# EAGLE design SprinklerController (EAGLE 7.6.0)
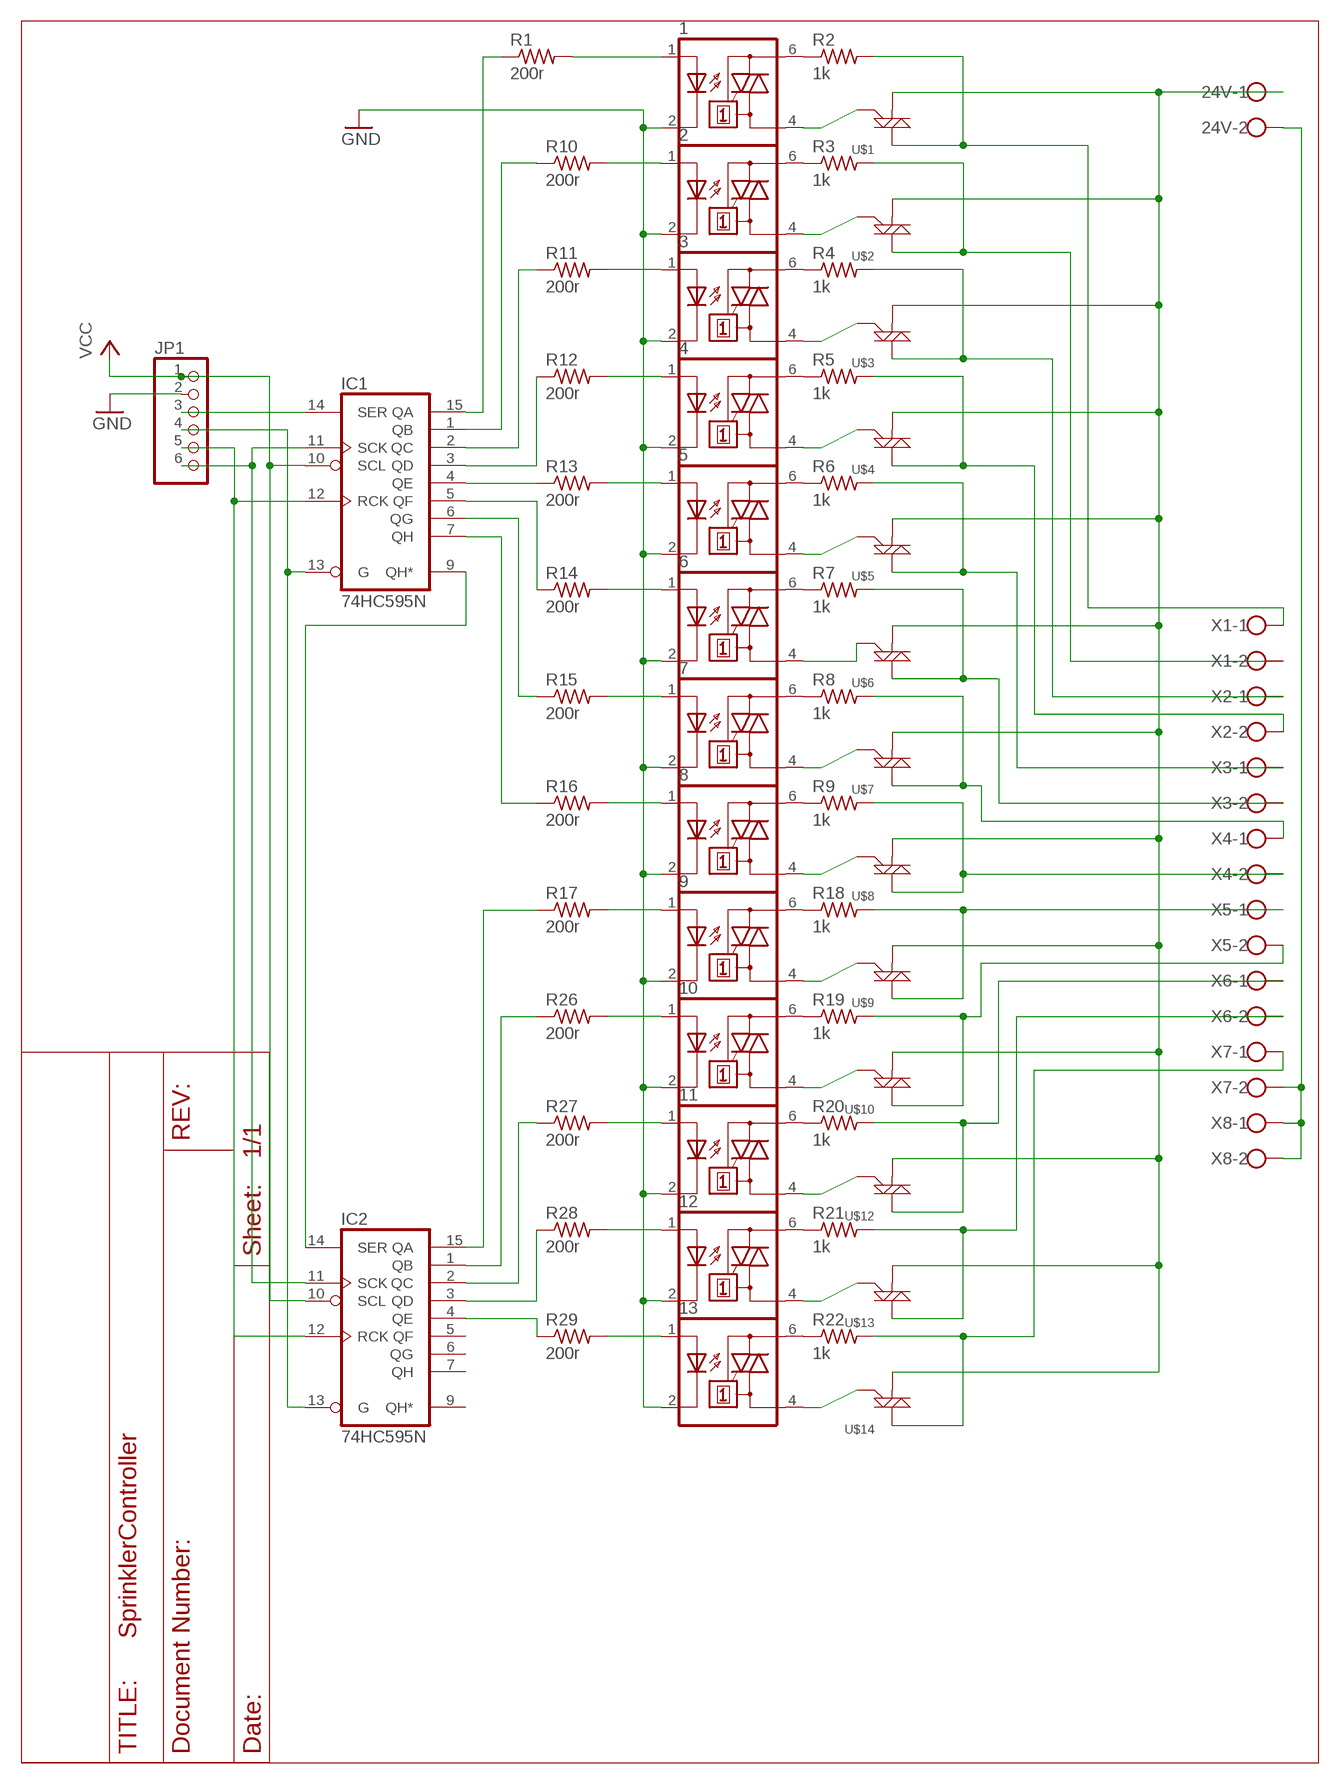
[diagram p0: schematic, sheet 1]

## Parts
1  MOC3021M  [DIL06]
2  MOC3021M  [DIL06]
3  MOC3021M  [DIL06]
4  MOC3021M  [DIL06]
5  MOC3021M  [DIL06]
6  MOC3021M  [DIL06]
7  MOC3021M  [DIL06]
8  MOC3021M  [DIL06]
9  MOC3021M  [DIL06]
10  MOC3021M  [DIL06]
11  MOC3021M  [DIL06]
12  MOC3021M  [DIL06]
13  MOC3021M  [DIL06]
24V  W237-102  [W237-102]
IC1  74HC595N  74LS595N  [DIL16]
IC2  74HC595N  74LS595N  [DIL16]
JP1  PINHD-1X6  [1X06]
R1  200r  R-US_0204/7  [0204/7]
R2  1k  R-US_0204/7  [0204/7]
R3  1k  R-US_0204/7  [0204/7]
R4  1k  R-US_0204/7  [0204/7]
R5  1k  R-US_0204/7  [0204/7]
R6  1k  R-US_0204/7  [0204/7]
R7  1k  R-US_0204/7  [0204/7]
R8  1k  R-US_0204/7  [0204/7]
R9  1k  R-US_0204/7  [0204/7]
R10  200r  R-US_0204/7  [0204/7]
R11  200r  R-US_0204/7  [0204/7]
R12  200r  R-US_0204/7  [0204/7]
R13  200r  R-US_0204/7  [0204/7]
R14  200r  R-US_0204/7  [0204/7]
R15  200r  R-US_0204/7  [0204/7]
R16  200r  R-US_0204/7  [0204/7]
R17  200r  R-US_0204/7  [0204/7]
R18  1k  R-US_0204/7  [0204/7]
R19  1k  R-US_0204/7  [0204/7]
R20  1k  R-US_0204/7  [0204/7]
R21  1k  R-US_0204/7  [0204/7]
R22  1k  R-US_0204/7  [0204/7]
R26  200r  R-US_0204/7  [0204/7]
R27  200r  R-US_0204/7  [0204/7]
R28  200r  R-US_0204/7  [0204/7]
R29  200r  R-US_0204/7  [0204/7]
U$1  TRIACPTH  [TO-92]
U$2  TRIACPTH  [TO-92]
U$3  TRIACPTH  [TO-92]
U$4  TRIACPTH  [TO-92]
U$5  TRIACPTH  [TO-92]
U$6  TRIACPTH  [TO-92]
U$7  TRIACPTH  [TO-92]
U$8  TRIACPTH  [TO-92]
U$9  TRIACPTH  [TO-92]
U$10  TRIACPTH  [TO-92]
U$12  TRIACPTH  [TO-92]
U$13  TRIACPTH  [TO-92]
U$14  TRIACPTH  [TO-92]
X1  W237-102  [W237-102]
X2  W237-102  [W237-102]
X3  W237-102  [W237-102]
X4  W237-102  [W237-102]
X5  W237-102  [W237-102]
X6  W237-102  [W237-102]
X7  W237-102  [W237-102]
X8  W237-102  [W237-102]

## Nets
GND: 1.2(C) 2.2(C) 3.2(C) 4.2(C) 5.2(C) 6.2(C) 7.2(C) 8.2(C) 9.2(C) 10.2(C) 11.2(C) 12.2(C) 13.2(C) JP1.2
N$1: IC1.12(RCK) IC2.12(RCK) JP1.5
N$2: IC1.14(SER) JP1.3
N$3: IC1.13(G) IC2.13(G) JP1.4
N$4: 1.4(A1) U$1.2(G)
N$5: IC1.11(SCK) IC2.11(SCK) JP1.6
N$6: R19.2 U$10.3(M2) X5.2
N$7: R2.2 U$1.3(M2) X1.1
N$8: 24V.1 U$1.1(M1) U$2.1(M1) U$3.1(M1) U$4.1(M1) U$5.1(M1) U$6.1(M1) U$7.1(M1) U$8.1(M1) U$9.1(M1) U$10.1(M1) U$12.1(M1) U$13.1(M1) U$14.1(M1)
N$9: 1.1(A) R1.2
N$10: IC1.9(QH*) IC2.14(SER)
N$11: IC1.7(QH) R16.1
N$12: 1.6(A2) R2.1
N$13: 2.6(A2) R3.1
N$14: 3.6(A2) R4.1
N$15: 4.6(A2) R5.1
N$16: 5.6(A2) R6.1
N$17: 6.6(A2) R7.1
N$18: 7.6(A2) R8.1
N$19: 8.6(A2) R9.1
N$20: 10.4(A1) U$10.2(G)
N$21: 24V.2 X7.2 X8.1 X8.2
N$24: 13.4(A1) U$14.2(G)
N$25: 12.4(A1) U$13.2(G)
N$26: 11.4(A1) U$12.2(G)
N$27: R4.2 U$3.3(M2) X2.1
N$28: R5.2 U$4.3(M2) X2.2
N$29: R6.2 U$5.3(M2) X3.1
N$30: R7.2 U$6.3(M2) X3.2
N$31: R8.2 U$7.3(M2) X4.1
N$32: 2.1(A) R10.2
N$33: 9.4(A1) U$9.2(G)
N$34: 3.1(A) R11.2
N$35: 4.1(A) R12.2
N$36: R9.2 U$8.3(M2) X4.2
N$37: 5.1(A) R13.2
N$38: 6.1(A) R14.2
N$39: 7.1(A) R15.2
N$40: 8.1(A) R16.2
N$41: IC1.6(QG) R15.1
N$42: IC1.5(QF) R14.1
N$43: IC1.4(QE) R13.1
N$44: IC1.3(QD) R12.1
N$45: IC1.2(QC) R11.1
N$46: IC1.1(QB) R10.1
N$47: 8.4(A1) U$8.2(G)
N$48: IC1.15(QA) R1.1
N$49: IC2.4(QE) R29.1
N$50: 9.6(A2) R18.1
N$51: 10.6(A2) R19.1
N$52: 11.6(A2) R20.1
N$53: 12.6(A2) R21.1
N$54: 13.6(A2) R22.1
N$58: 7.4(A1) U$7.2(G)
N$59: 6.4(A1) U$6.2(G)
N$60: 5.4(A1) U$5.2(G)
N$61: 4.4(A1) U$4.2(G)
N$62: 3.4(A1) U$3.2(G)
N$63: 2.4(A1) U$2.2(G)
N$65: R20.2 U$12.3(M2) X6.1
N$66: R21.2 U$13.3(M2) X6.2
N$67: R22.2 U$14.3(M2) X7.1
N$70: R3.2 U$2.3(M2) X1.2
N$71: R18.2 U$9.3(M2) X5.1
N$73: 9.1(A) R17.2
N$74: 10.1(A) R26.2
N$75: 11.1(A) R27.2
N$76: 12.1(A) R28.2
N$77: 13.1(A) R29.2
N$81: IC2.15(QA) R17.1
N$84: IC2.1(QB) R26.1
N$85: IC2.2(QC) R27.1
N$86: IC2.3(QD) R28.1
VCC: IC1.10(SCL) IC2.10(SCL) JP1.1
Unconnected: IC2.5(QF) IC2.6(QG) IC2.7(QH) IC2.9(QH*)

## Power pins joined to a net without a drawn wire
GND: IC1.8(GND) IC2.8(GND)
VCC: IC1.16(VCC) IC2.16(VCC)

## Library data of the parts
1-13 = optocoupler:MOC30*M: RANDOM-PHASE OPTOISOLATORS TRIAC DRIVER OUTPUT Source: http://www.fairchildsemi.com MOC3020-M.pdf; MF: FAIRCHILD SEMICONDUCTOR; MPN: MOC3021-M; OC_FARNELL: 1021365; OC_NEWARK: 95B7895
24V X1-X8 = con-wago-500:W237-102: WAGO SCREW CLAMP; MPN: 237-102; OC_FARNELL: unknown; OC_NEWARK: 70K9898
IC1 IC2 = 74xx-us:74*595: 8-bit SHIFT REGISTER, output latch
JP1 = pinhead:PINHD-1X6: PIN HEADER
R1-R22 R26-R29 = rcl:R-US_: RESISTOR, American symbol
U$1-U$10 U$12-U$14 = SparkFun-DiscreteSemi:TRIAC: Low-power generic TRIAC packages

## Board
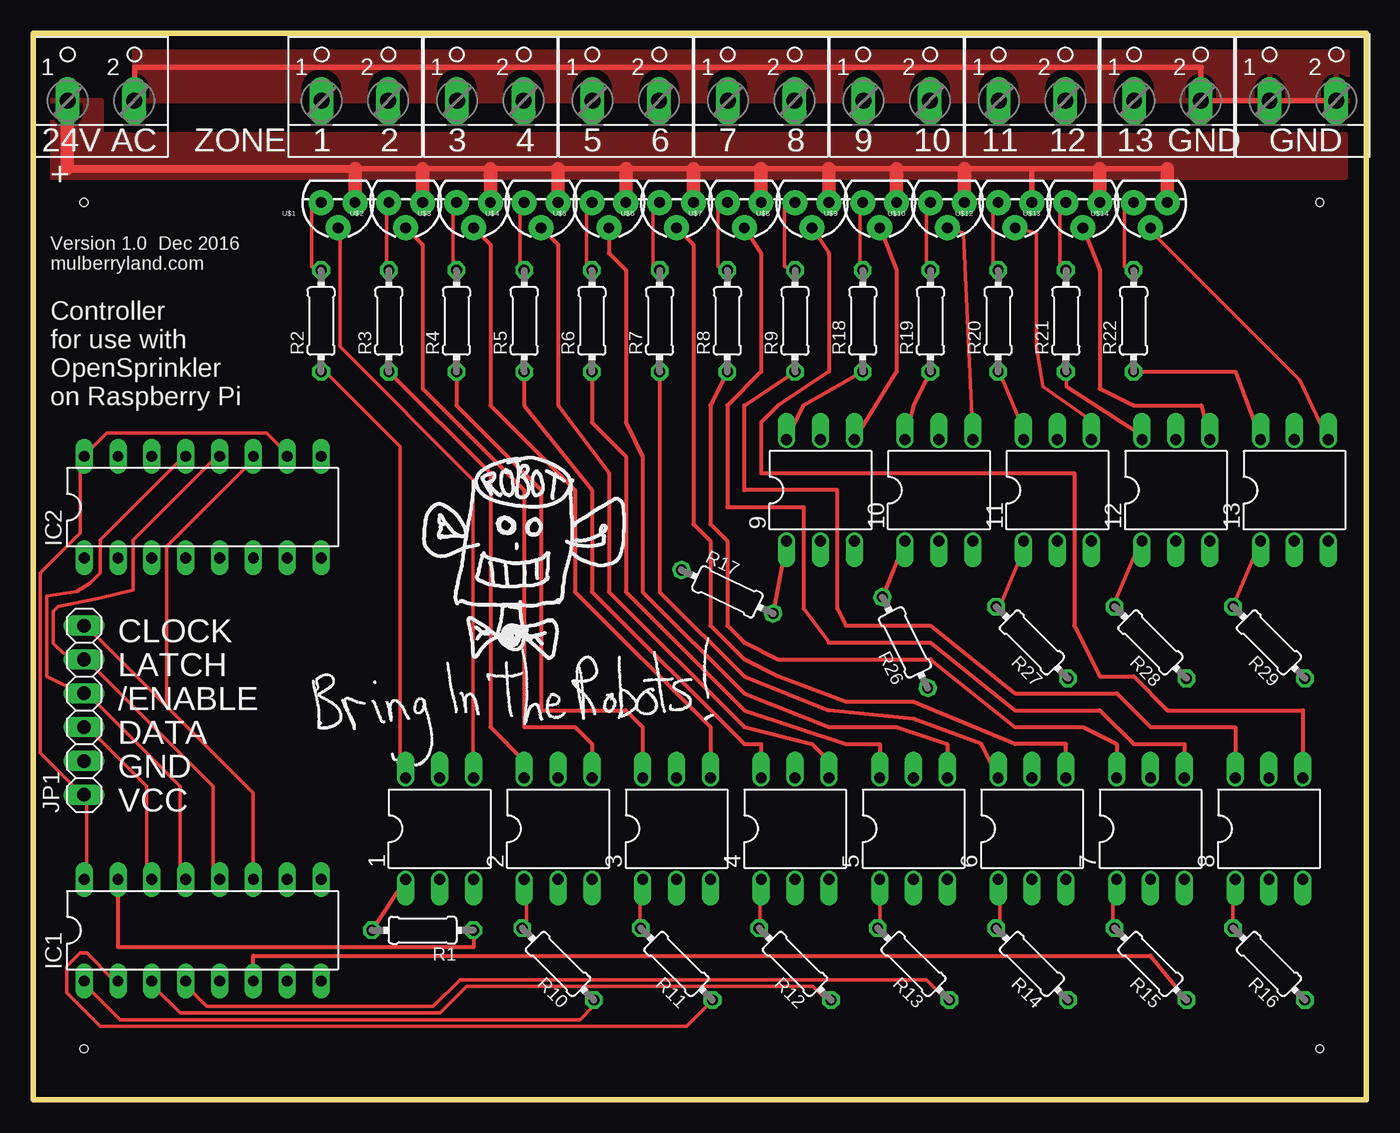
[diagram p1: board, top side]
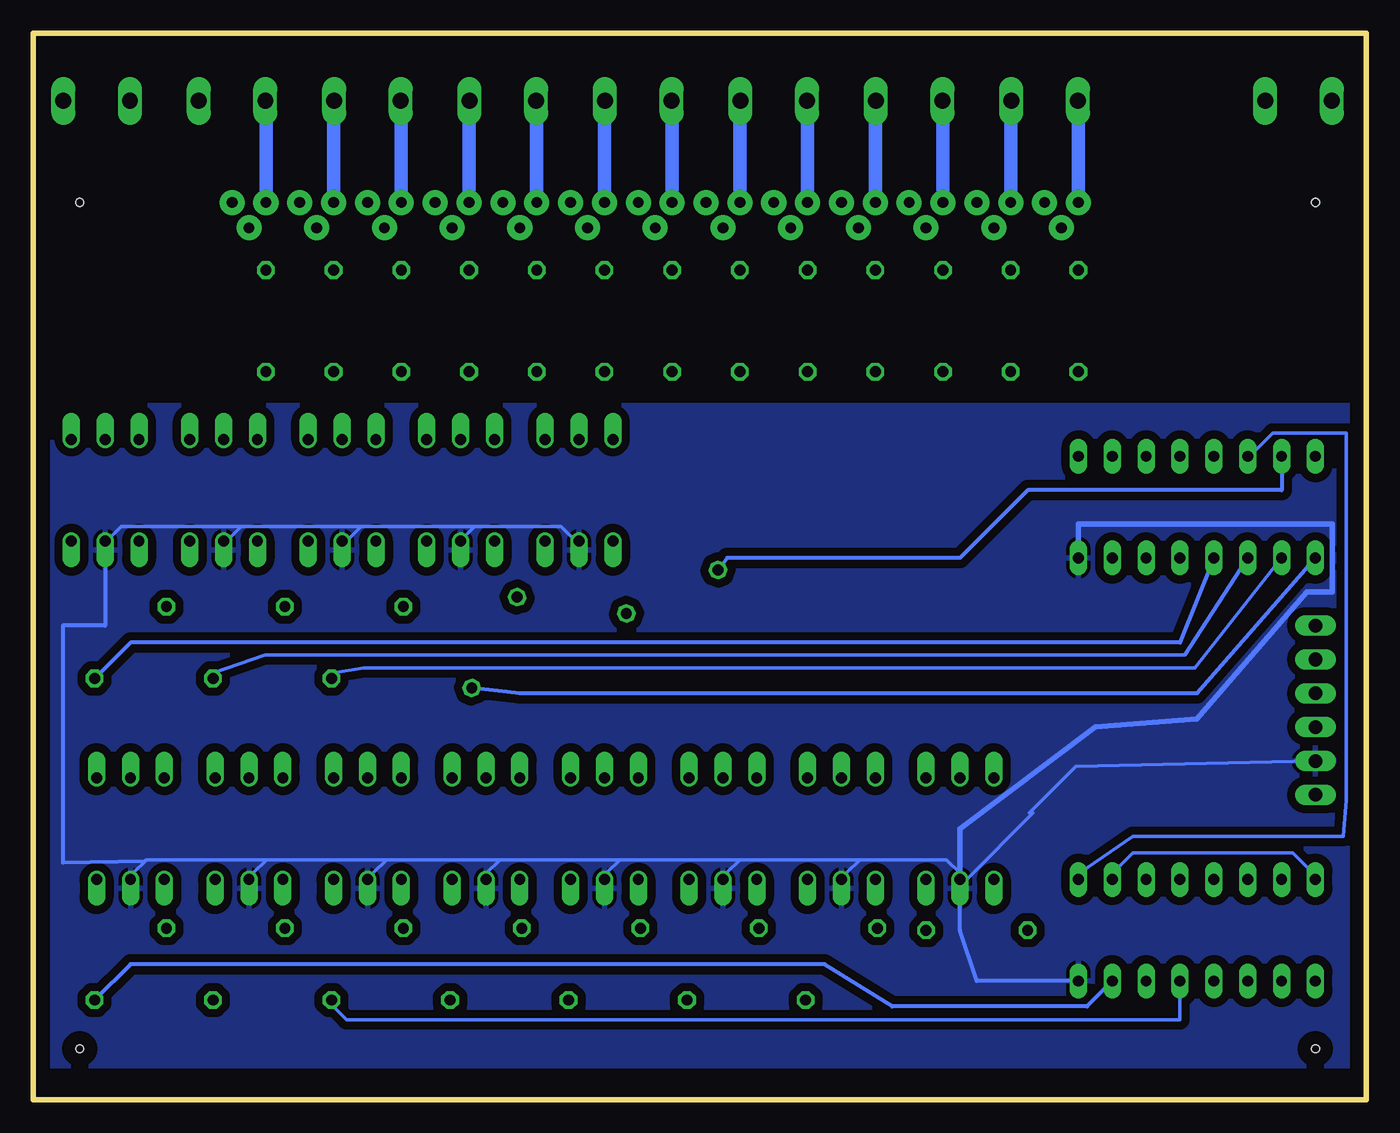
[diagram p2: board, bottom side, seen from below]

Size 100 x 80 mm. Coordinates in mm from the lower left corner, seen from the top.
Outline: 0,0 100,0 100,80 0,80 0,0
Copper layers (1*16): Top 0.035mm / dielectric 1.5mm / Bottom 0.035mm
Design rules "default": minimum track width 10mil, minimum drill 24mil, track to track 8mil, track to pad 8mil, pad to pad 8mil, via to via 8mil, smd to smd 8mil, copper to edge 40mil, drill to drill 8mil, minimum pad ring 10mil, minimum via ring 8mil, stop-mask expansion 4mil, vias tented up to drill 0mil, thermal gap 10mil
Holes 0.6 mm at 96.52,67.31 96.52,3.81 3.81,3.81 3.81,67.31

### Footprints (pad centres in the part's own frame; a part is rotated, then mirrored left to right if it is on the bottom)
DIL06 = drill 0.813 offset: 1 -2.54,-3.81; 2 0,-3.81; 3 2.54,-3.81; 4 2.54,3.81; 5 0,3.81; 6 -2.54,3.81
W237-102 = drill 1.194 long: 1 -2.5,-1.27; 2 2.5,-1.27
DIL16 = drill 0.813 long: 1 -8.89,-3.81; 2 -6.35,-3.81; 3 -3.81,-3.81; 4 -1.27,-3.81; 5 1.27,-3.81; 6 3.81,-3.81; 7 6.35,-3.81; 8 8.89,-3.81; 9 8.89,3.81; 10 6.35,3.81; 11 3.81,3.81; 12 1.27,3.81; 13 -1.27,3.81; 14 -3.81,3.81; 15 -6.35,3.81; 16 -8.89,3.81
1X06 = drill 1.016 long: 1 -6.35,0; 2 -3.81,0; 3 -1.27,0; 4 1.27,0; 5 3.81,0; 6 6.35,0
0204/7 = drill 0.813 octagon: 1 -3.81,0; 2 3.81,0
TO-92 = drill 0.813 pad 1.88: 1 -1.27,0; 2 0,1.905; 3 1.27,0

### Placement (x,y rotation side)
1  30.48,20.32 0 top
2  39.37,20.32 0 top
3  48.26,20.32 0 top
4  57.15,20.32 0 top
5  66.04,20.32 0 top
6  74.93,20.32 0 top
7  83.82,20.32 0 top
8  92.71,20.32 0 top
9  59.05,45.72 0 top
10  67.94,45.72 0 top
11  76.83,45.72 0 top
12  85.72,45.72 0 top
13  94.61,45.72 0 top
24V  5.08,76.2 0 top
IC1  12.7,12.7 0 top
IC2  12.7,44.45 0 top
JP1  3.81,29.21 90 top
R1  29.21,12.7 180 top
R2  21.59,58.42 90 top
R3  26.67,58.42 90 top
R4  31.75,58.42 90 top
R5  36.83,58.42 90 top
R6  41.91,58.42 90 top
R7  46.99,58.42 90 top
R8  52.07,58.42 90 top
R9  57.15,58.42 90 top
R10  39.37,10.16 135 top
R11  48.26,10.16 135 top
R12  57.15,10.16 135 top
R13  66.04,10.16 135 top
R14  74.93,10.16 135 top
R15  83.82,10.16 135 top
R16  92.71,10.16 135 top
R17  52.07,38.1 334.5 top
R18  62.23,58.42 90 top
R19  67.31,58.42 90 top
R20  72.39,58.42 90 top
R21  77.47,58.42 90 top
R22  82.55,58.42 90 top
R26  65.41,34.29 116.5 top
R27  74.93,34.29 135 top
R28  83.82,34.29 135 top
R29  92.71,34.29 135 top
U$1  22.86,67.31 180 top
U$2  27.94,67.31 180 top
U$3  33.02,67.31 180 top
U$4  38.1,67.31 180 top
U$5  43.18,67.31 180 top
U$6  48.26,67.31 180 top
U$7  53.34,67.31 180 top
U$8  58.42,67.31 180 top
U$9  63.5,67.31 180 top
U$10  68.58,67.31 180 top
U$12  73.66,67.31 180 top
U$13  78.74,67.31 180 top
U$14  83.82,67.31 180 top
X1  24.13,76.2 0 top
X2  34.29,76.2 0 top
X3  44.45,76.2 0 top
X4  54.61,76.2 0 top
X5  64.77,76.2 0 top
X6  74.93,76.2 0 top
X7  85.09,76.2 0 top
X8  95.25,76.2 0 top

### Tracks (layer width: path | path; a pad name or v marks a point on that pad's centre or on a via)
GND
  Bottom 0.254: 66.91,43 60.41,43 59.41,42 9.2 | 66.91,43 67.91,42 10.2 | 75.41,43 76.41,42 11.2 | 66.91,43 75.41,43 | 84.41,43 85.41,42 12.2 | 75.41,43 84.41,43 | 84.41,43 93.41,43 94.41,42 13.2 | 38,18 39,17 2.2 | 38,18 31.5,18 30.5,17 1.2 30,16.5 25,21.5 25.28,21.5 21.78,25 JP1.2 | 47,18 48,17 3.2 | 38,18 47,18 | 56,18 57,17 4.2 | 47,18 56,18 | 65,18 66,17 5.2 | 56,18 65,18 | 73.5,18 74.5,17 6.2 | 65,18 73.5,18 | 82.5,18 83.5,17 7.2 | 73.5,18 82.5,18 | 82.5,18 91.5,18 91.58,17.92 92.5,17 8.2
  Bottom 0.305: IC1.8 29.21,8.89 30.48,12.7 1.2 | 13.2 94.61,35.56 97.79,35.56 97.79,17.78 91.58,17.92
  Bottom 0.406: 1.2 30.48,20.32 20.32,27.94 12.7,28.57 4.45,38.1 2.54,38.1 2.54,43.18 21.59,43.18 IC2.8
  pour Bottom (isolate 0.61): 99.06,2.54 1.27,2.54 1.27,52.07 99.06,52.07
N$1
  Top 0.254: IC1.12 13.5,17 13.5,23.5 4,33 JP1.5 2.23,33.5 1.5,34.23 1.5,36.63 1.86,37 5,37.63 7.5,38.23 7.5,42 13.5,48 IC2.12
N$2
  Top 0.254: IC1.14 8.5,17 8.5,23.5 4,28 JP1.3
N$3
  Top 0.254: IC1.13 11,17 11,23.5 4,30.5 JP1.4 3.5,30.5 1,31.73 1,37.77 3.27,38.13 4.27,38.77 5,39.5 5,42 11,48 IC2.13
N$4
  Top 0.254: 1.4 33,24.5 33,46.5 23,56.5 23,65 U$1.2
N$5
  Top 0.254: 10,29.5 4,35.5 JP1.6 | 10,29.5 16.5,23 16.5,17 IC1.11 | 10,29.5 10,41.5 16.5,48 IC2.11
N$6
  Top 0.254: R19.2 67,62.5 67,67 U$10.3
  Bottom 0.254: 67.5,67.5 U$10.3
  Bottom 0.406: X5.2 67.31,74.93
  Bottom 1.016: 67.31,74.93 U$10.3
N$7
  Top 0.254: R2.2 20.86,62.5 20.86,67 U$1.3
  Bottom 0.406: X1.1 21.59,74.93
  Bottom 1.016: 21.59,74.93 U$1.3
N$8
  Top 0.254: 34,67.5 U$3.1 | 29.5,67.5 U$2.1 | 39,67.5 U$4.1
  Top 0.406: 24V.1 2.54,74.93 | 24.13,69.85 29.21,69.85 34.29,69.85 39.37,69.85 44.45,69.85 49.53,69.85 54.61,69.85 59.69,69.85 64.77,69.85 69.85,69.85 74.93,69.85 | 85.09,69.85 80.01,69.85 74.93,69.85 | U$12.1 74.93,69.85 | 39,67.5 39.37,67.5 | 34,67.5 34.29,67.5
  Top 0.61: 2.54,69.85 24.13,69.85
  Top 1.016: 2.54,74.93 2.54,69.85 | 24.13,69.85 U$1.1 | U$2.1 29.21,69.85 | U$14.1 85.09,69.85 | U$13.1 80.01,69.85 | U$10.1 69.85,69.85 | U$9.1 64.77,69.85 | U$8.1 59.69,69.85 | U$7.1 54.61,69.85 | U$6.1 49.53,69.85 | U$5.1 44.45,69.85 | 39.37,67.5 39.37,69.85 | 34.29,67.5 34.29,69.85
  Bottom 0.254: 29.5,67 U$2.1
  pour Top (isolate 0.61): 1.27,74.93 1.27,69.22 98.42,69.22 98.42,72.39 5.08,72.39 5.08,74.93
N$9
  Top 0.305: R1.2 1.1
N$10
  Bottom 0.254: IC1.9 21.5,17 17.5,19.73 1.73,19.73 1.5,22.5 1.5,50 7,50 8.5,48.5 IC2.14
N$11
  Bottom 0.305: IC1.7 20.95,6.99 35.56,6.99 40.64,10.16 92.71,10.16 R16.1
N$12
  Top 0.254: 1.6 27.5,24.5 27.5,49 22,54.5 R2.1
N$13
  Top 0.305: R3.1 34.29,46.99 34.29,27.94 36.83,25.4 2.6
N$14
  Top 0.305: R4.1 31.75,52.07 38.1,45.72 38.1,29.21 44.45,29.21 45.72,27.94 3.6
N$15
  Top 0.305: R5.1 36.83,52.07 41.91,45.72 41.91,38.1 53.34,26.67 54.61,26.67 4.6
N$16
  Top 0.305: R6.1 41.91,50.8 44.45,48.26 44.45,38.1 53.34,29.21 60.96,26.67 63.5,26.67 5.6
N$17
  Top 0.305: R7.1 46.99,38.1 53.34,31.75 59.69,29.21 66.04,28.57 71.12,26.67 6.6
N$18
  Top 0.305: R8.1 50.8,52.07 50.8,43.18 52.07,41.91 52.07,35.56 53.34,34.29 55.88,33.02 67.31,33.02 73.66,27.94 78.74,27.94 81.28,26.67 7.6
N$19
  Top 0.305: 8.6 90.17,27.94 83.82,27.94 81.28,30.48 73.66,30.48 67.31,35.56 60.96,35.56 60.33,36.83 60.33,45.72 53.34,45.72 53.34,52.07 R9.1
N$20
  Top 0.254: 10.4 70.41,51.27 69.77,65 U$10.2
N$21
  Top 0.406: 24V.2 7.62,74.93 7.62,77.47 87.59,77.47 | 87.63,77.47 87.59,77.47 | 87.59,77.47 X7.2 X8.1 X8.2
  pour Top (isolate 0.61): 7.62,79.38 7.62,74.93 99.06,74.93 99.06,79.38
N$24
  Top 0.254: 13.4 96.91,50 95,54 84,65 U$14.2
N$25
  Top 0.305: U$13.2 80.01,62.23 80.01,53.34 82.55,52.07 87.63,52.07 12.4
N$26
  Top 0.254: 11.4 78.91,51.27 75.73,53.5 75.27,56.5 75.27,65 U$12.2
N$27
  Top 0.254: R4.2 31.5,62.5 31.5,67 U$3.3
  Bottom 0.254: 32,67.5 U$3.3
  Bottom 0.406: X2.1 31.75,74.93
  Bottom 1.016: 31.75,74.93 U$3.3
N$28
  Top 0.254: R5.2 36.5,62.5 36.5,67 U$4.3
  Bottom 0.254: 37,67.5 U$4.3
  Bottom 0.406: X2.2 36.83,74.93
  Bottom 1.016: 36.83,74.93 U$4.3
N$29
  Top 0.254: R6.2 41.5,62.5 41.5,67 U$5.3
  Bottom 0.254: 42,67.5 U$5.3
  Bottom 0.406: X3.1 41.91,74.93
  Bottom 1.016: 41.91,74.93 U$5.3
N$30
  Top 0.254: R7.2 46.5,62.5 46.5,67 U$6.3
  Bottom 0.254: 47,67.5 U$6.3
  Bottom 0.406: X3.2 46.99,74.93
  Bottom 1.016: 46.99,74.93 U$6.3
N$31
  Top 0.254: R8.2 51.37,62.5 51.37,67 U$7.3
  Bottom 0.254: 52.5,67.5 U$7.3
  Bottom 0.406: X4.1 52.07,74.93
  Bottom 1.016: 52.07,74.93 U$7.3
N$32
  Top 0.254: R10.2 37,13 37,16.5 2.1
N$33
  Top 0.305: U$9.2 64.77,62.23 64.77,54.61 9.4
N$34
  Top 0.254: R11.2 45.5,13 45.5,16.5 3.1
N$35
  Top 0.254: R12.2 54.5,13 54.5,16.5 4.1
N$36
  Top 0.254: R9.2 56.37,62.5 56.37,67 U$8.3
  Bottom 0.254: 57.5,67.5 U$8.3
  Bottom 0.406: X4.2 57.15,74.93
  Bottom 1.016: 57.15,74.93 U$8.3
N$37
  Top 0.254: 5.1 63.5,13 R13.2
N$38
  Top 0.254: R14.2 72.5,13 72.5,16.5 6.1
N$39
  Top 0.254: R15.2 81,13 81,16.5 7.1
N$40
  Top 0.254: R16.2 90,13 90,16.5 8.1
N$41
  Top 0.305: IC1.6 16.51,10.79 83.82,10.79 R15.1
N$42
  Bottom 0.254: IC1.5 14,8.5 14,6 76.5,6 77.5,7 R14.1
N$43
  Top 0.254: IC1.4 11.5,8.5 13,7 30,7 32,9 67,9 68.5,7.5 R13.1
N$44
  Top 0.254: IC1.3 9,8.5 11,6.5 30.5,6.5 32.5,8.5 58.5,8.5 59.5,7.5 R12.1
N$45
  Top 0.254: IC1.2 6,9 4,11 3.5,11 2.5,10 2.5,8 5,5.5 49,5.5 50.5,7 R11.1
N$46
  Top 0.254: IC1.1 4,8.5 6.5,6 41,6 42,7 R10.1
N$47
  Top 0.305: U$8.2 59.69,63.5 59.69,54.61 55.88,52.07 54.61,50.8 54.61,46.99 78.11,46.99 78.11,35.56 80.01,31.75 82.55,31.75 85.09,29.21 95.25,29.21 8.4
N$48
  Top 0.305: R1.1 33.02,11.43 6.35,11.43 IC1.15
N$49
  Bottom 0.305: IC2.4 13.97,34.29 92.71,34.29 R29.1
N$50
  Top 0.305: 9.6 57.78,52.07 R18.1
N$51
  Top 0.305: R19.1 66.04,52.07 10.6
N$52
  Top 0.254: 11.6 74.41,50 72.5,54.5 R20.1
N$53
  Top 0.254: R21.1 77.5,54.5 77.5,53.5 82.91,50 12.6
N$54
  Top 0.305: R22.1 90.17,54.61 13.6
N$58
  Top 0.305: U$7.2 54.61,63.5 54.61,54.61 52.07,52.07 52.07,44.45 57.78,44.45 57.78,36.83 59.69,34.29 67.31,34.29 73.66,29.21 80.01,29.21 82.55,26.67 86.36,26.67 7.4
N$59
  Top 0.305: U$6.2 49.53,64.14 49.53,43.18 50.8,41.91 50.8,35.56 53.34,33.02 55.88,31.75 60.96,29.84 66.04,29.84 73.66,26.67 77.47,26.67 6.4
N$60
  Top 0.305: U$5.2 43.18,63.5 44.45,62.23 44.45,50.8 45.72,48.26 45.72,38.1 53.34,30.48 59.69,27.94 64.77,27.94 68.58,26.67 5.4
N$61
  Top 0.305: U$4.2 39.37,64.14 39.37,52.07 43.18,46.99 43.18,38.1 53.34,27.94 58.42,26.67 59.69,25.4 4.4
N$62
  Top 0.305: U$3.2 34.29,64.14 34.29,52.07 40.64,45.72 40.64,38.1 50.8,27.94 3.4
N$63
  Top 0.305: U$2.2 29.21,64.14 29.21,53.34 36.83,45.72 36.83,27.94 40.64,27.94 41.91,26.67 2.4
N$65
  Top 0.254: R20.2 72,62.5 72,67 U$12.3
  Bottom 0.254: 72.5,67.5 U$12.3
  Bottom 0.406: X6.1 72.39,74.93
  Bottom 1.016: 72.39,74.93 U$12.3
N$66
  Top 0.254: R21.2 77,62.5 77,67 U$13.3
  Bottom 0.254: 77.5,67.5 U$13.3
  Bottom 0.406: X6.2 77.47,74.93
  Bottom 1.016: 77.47,74.93 U$13.3
N$67
  Top 0.254: R22.2 81.86,62.5 81.86,67 U$14.3
  Bottom 0.254: 82.5,67.5 U$14.3 | X7.1 82.53,74.98 82.55,74.93
  Bottom 1.016: 82.55,74.93 U$14.3
N$70
  Top 0.254: R3.2 26.5,62.5 26.5,67 U$2.3
  Bottom 0.254: 27,67.5 U$2.3
  Bottom 0.406: X1.2 26.67,74.93
  Bottom 1.016: 26.67,74.93 U$2.3
N$71
  Top 0.254: R18.2 62,62.5 62,67 U$9.3
  Bottom 0.254: 62.5,67.5 U$9.3
  Bottom 0.406: X5.1 62.23,74.93
  Bottom 1.016: 62.23,74.93 U$9.3
N$73
  Top 0.305: 9.1 R17.2
N$74
  Top 0.305: 10.1 R26.2
N$75
  Top 0.254: R27.2 72.5,37 74.41,41.5 11.1
N$76
  Top 0.254: R28.2 81,37 82.91,41.5 12.1
N$77
  Top 0.254: R29.2 90,37 91.91,41.5 13.1
N$81
  Bottom 0.305: IC2.15 6.35,45.72 25.4,45.72 30.48,40.64 47.95,40.64 R17.1
N$84
  Bottom 0.305: IC2.1 12.7,30.48 63.5,30.48 R26.1
N$85
  Bottom 0.254: IC2.2 6.5,40.5 12.85,32.37 75.23,32.37 77.5,32 R27.1
N$86
  Bottom 0.254: IC2.3 9,40.5 13.6,33.37 82.59,33.37 86.5,32 R28.1
VCC
  Top 0.254: IC2.10 19,48.5 17.5,50 5.5,50 4,48.5 IC2.16 3.5,48 3.5,42.5 0.5,39.5 0.5,26 3.5,23 JP1.1 4,22.5 4,17 IC1.16
  Bottom 0.254: IC1.10 19,17 17.5,18.5 5.5,18.5 4,17 IC1.16

### Text on the board
tNames: 24V AC | ZONE | 1 | 2 | 3 | 4 | 5 | 6 | 7 | 8 | 9 | 10 | 11 | 12 | 13 | GND | GND | + | Version 1.0 Dec 2016 / mulberryland.com | Controller / for use with / OpenSprinkler / on Raspberry Pi | CLOCK | LATCH | /ENABLE | DATA | GND | VCC